# EAGLE schematic board (EAGLE 6.5.0)

## Sheet 1 of 4: Digital I/O
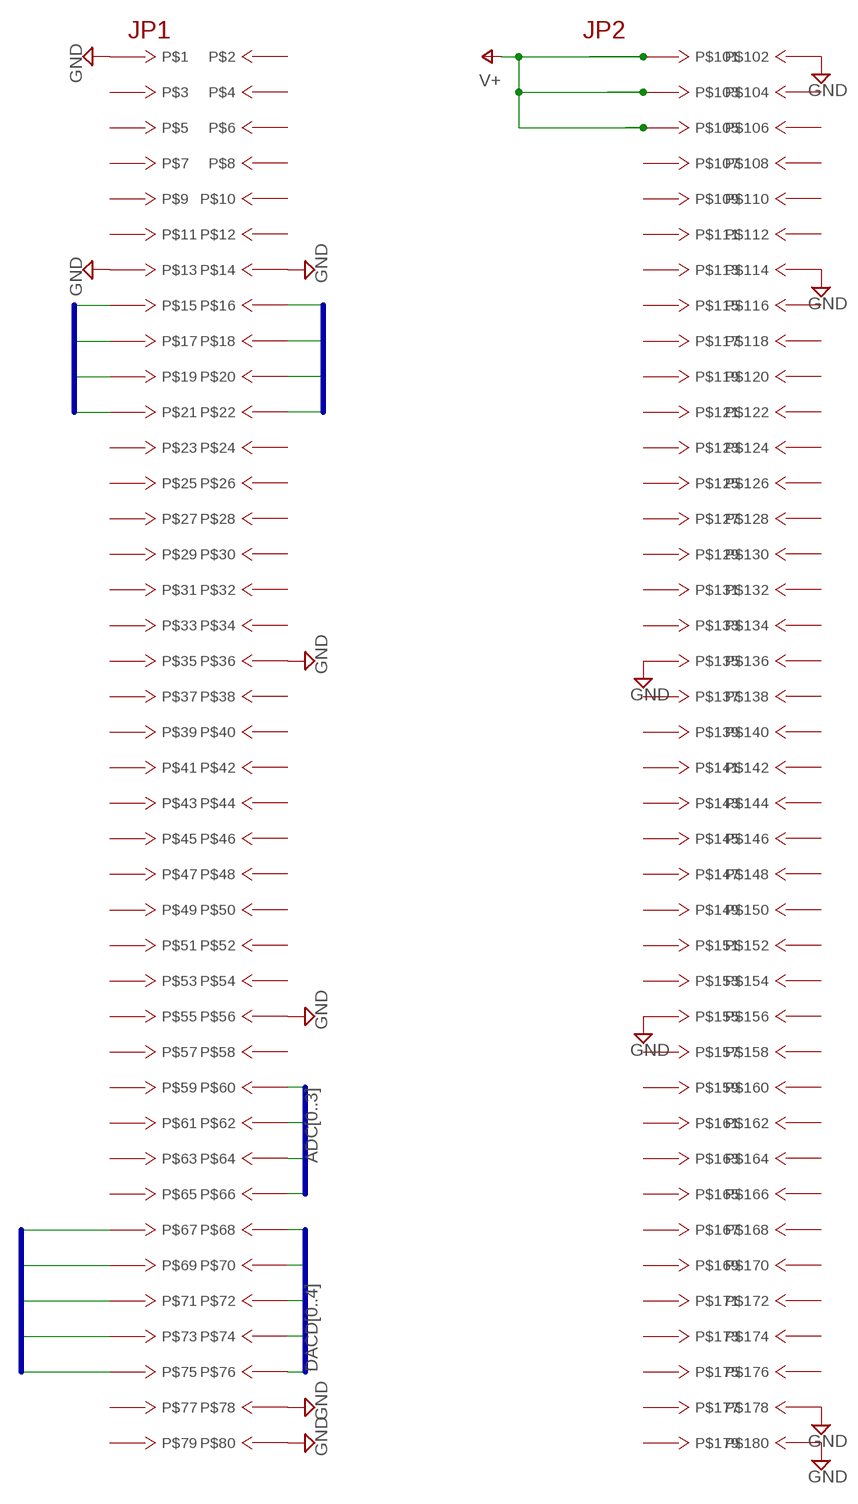
[diagram p0: schematic, sheet 1]

### Parts
J1  XEM6310  [XEM6310]

### Nets
ADC0: J1.266 ; also sheet 3
ADC1: J1.264 ; also sheet 3
ADC2: J1.262 ; also sheet 3
ADC3: J1.260 ; also sheet 3
ADC7: J1.222 ; also sheet 3
ADC8: J1.220 ; also sheet 3
ADC9: J1.218 ; also sheet 3
ADC10: J1.216 ; also sheet 3
ADC11: J1.221 ; also sheet 3
ADC12: J1.219 ; also sheet 3
ADC13: J1.217 ; also sheet 3
ADC14: J1.215 ; also sheet 3
DACD0: J1.268 ; also sheet 4
DACD1: J1.270 ; also sheet 4
DACD2: J1.272 ; also sheet 4
DACD3: J1.274 ; also sheet 4
DACD4: J1.276 ; also sheet 4
DACD5: J1.267 ; also sheet 4
DACD6: J1.269 ; also sheet 4
DACD7: J1.271 ; also sheet 4
DACD8: J1.273 ; also sheet 4
DACD9: J1.275 ; also sheet 4
GND: J1.102 J1.114 J1.135 J1.155 J1.178 J1.180 J1.201 J1.213 J1.214 J1.236 J1.256 J1.278 J1.280 ; also sheet 2,3,4
V+: J1.101 J1.103 J1.105 ; also sheet 2
Unconnected: J1.104 J1.106 J1.107 J1.108 J1.109 J1.110 J1.111 J1.112 J1.113 J1.115 J1.116 J1.117 J1.118 J1.119 J1.120 J1.121 J1.122 J1.123 J1.124 J1.125 J1.126 J1.127 J1.128 J1.129 J1.130 J1.131 J1.132 J1.133 J1.134 J1.136 J1.137 J1.138 J1.139 J1.140 J1.141 J1.142 J1.143 J1.144 J1.145 J1.146 J1.147 J1.148 J1.149 J1.150 J1.151 J1.152 J1.153 J1.154 J1.156 J1.157 J1.158 J1.159 J1.160 J1.161 J1.162 J1.163 J1.164 J1.165 J1.166 J1.167 J1.168 J1.169 J1.170 J1.171 J1.172 J1.173 J1.174 J1.175 J1.176 J1.177 J1.179 J1.202 J1.203 J1.204 J1.205 J1.206 J1.207 J1.208 J1.209 J1.210 J1.211 J1.212 J1.223 J1.224 J1.225 J1.226 J1.227 J1.228 J1.229 J1.230 J1.231 J1.232 J1.233 J1.234 J1.235 J1.237 J1.238 J1.239 J1.240 J1.241 J1.242 J1.243 J1.244 J1.245 J1.246 J1.247 J1.248 J1.249 J1.250 J1.251 J1.252 J1.253 J1.254 J1.255 J1.257 J1.258 J1.259 J1.261 J1.263 J1.265 J1.277 J1.279

### Buses
DACD[0..4]
ADC[0..3]
ADC[7..10]
ADC[11..14]
DACD[5..9]

## Sheet 2 of 4: Power
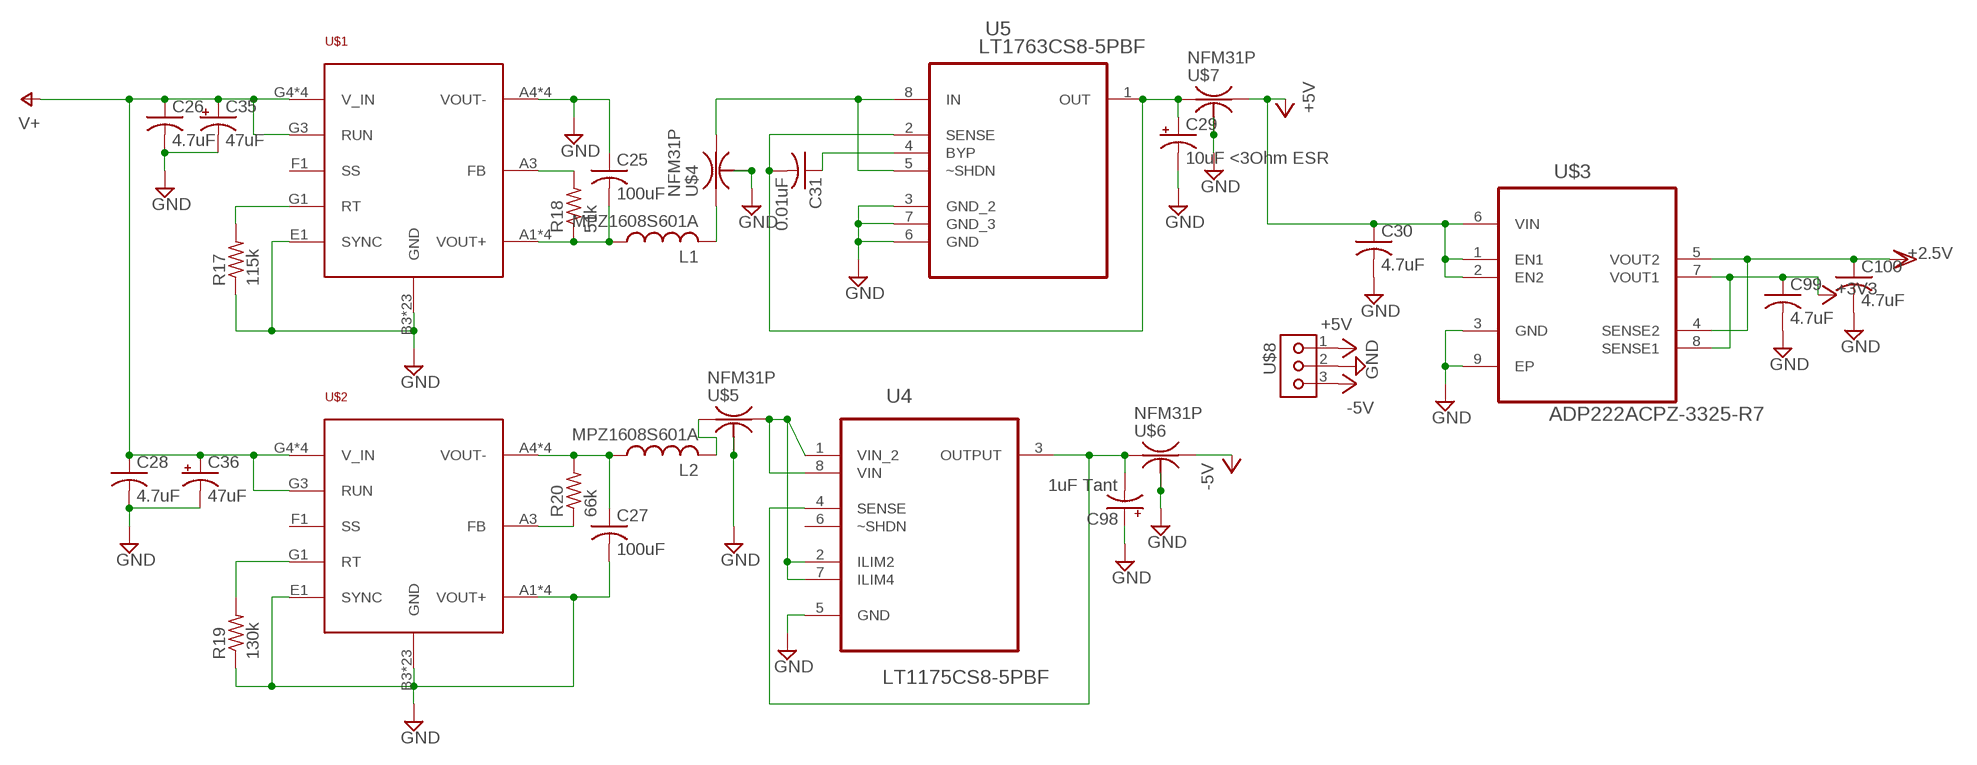
[diagram p1: schematic, sheet 2]

### Parts
C25  100uF  C-USC1210  [C1210]
C26  4.7uF  C-USC0603  [C0603]
C27  100uF  C-USC1210  [C1210]
C28  4.7uF  C-USC0603  [C0603]
C29  10uF <3Ohm ESR  CPOL-US  [C0603T]
C30  4.7uF  C-USC0603  [C0603]
C31  0.01uF  C-USC0603  [C0603]
C35  47uF  CPOL-USUD-4X5,8  [UD-4X5,8_NICHICON]
C36  47uF  CPOL-USUD-4X5,8  [UD-4X5,8_NICHICON]
C98  1uF Tant  CPOL-US  [C0603T]
C99  4.7uF  C-USC0603  [C0603]
C100  4.7uF  C-USC0603  [C0603]
L1  MPZ1608S601A  L-US  [C0603]
L2  MPZ1608S601A  L-US  [C0603]
R17  115k  R-US_R0603  [R0603]
R18  51k  R-US_R0603  [R0603]
R19  130k  R-US_R0603  [R0603]
R20  66k  R-US_R0603  [R0603]
U4  LT1175CS8-5PBF  [SOIC127P600X175-8N]
U5  LT1763CS8-5PBF  [SOIC127P600X175-8N]
U$1  LTM8045  [BGA-40]
U$2  LTM8045  [BGA-40]
U$3  ADP222ACPZ-3325-R7  [QFN50P200X200X60-9N]
U$4  NFM31P  [NFM31P]
U$5  NFM31P  [NFM31P]
U$6  NFM31P  [NFM31P]
U$7  NFM31P  [NFM31P]
U$8  KK3V  [KK-V-3]

### Nets
+3V3: C99.1 U$3.7(VOUT1) U$3.8(SENSE1) ; also sheet 3,4
+5V: C30.1 U$3.1(EN1) U$3.2(EN2) U$3.6(VIN) U$7.OUT U$8.1 ; also sheet 3,4
-5V: U$6.OUT U$8.3 ; also sheet 3,4
GND: C25.1 C26.2 C27.2 C28.2 C29.- C30.2 C35.- C36.- C98.+ C99.2 C100.2 R17.1 R19.1 U4.5(GND) U5.3(GND_2) U5.6(GND) U5.7(GND_3) U$1.A4(VOUT-) U$1.A5(VOUT-) U$1.B3(GND) U$1.B4(VOUT-) U$1.B5(VOUT-) U$1.C1(GND) U$1.C2(GND) U$1.C3(GND) U$1.C4(GND) U$1.C5(GND) U$1.D1(GND) U$1.D2(GND) U$1.D3(GND) U$1.D4(GND) U$1.D5(GND) U$1.E1(SYNC) U$1.E2(GND) U$1.E3(GND) U$1.E4(GND) U$1.E5(GND) U$1.F2(GND) U$1.F3(GND) U$1.F4(GND) U$1.F5(GND) U$1.G2(GND) U$1.H1(GND) U$1.H2(GND) U$1.H3(GND) U$2.A1(VOUT+) U$2.A2(VOUT+) U$2.B1(VOUT+) U$2.B2(VOUT+) U$2.B3(GND) U$2.C1(GND) U$2.C2(GND) U$2.C3(GND) U$2.C4(GND) U$2.C5(GND) U$2.D1(GND) U$2.D2(GND) U$2.D3(GND) U$2.D4(GND) U$2.D5(GND) U$2.E1(SYNC) U$2.E2(GND) U$2.E3(GND) U$2.E4(GND) U$2.E5(GND) U$2.F2(GND) U$2.F3(GND) U$2.F4(GND) U$2.F5(GND) U$2.G2(GND) U$2.H1(GND) U$2.H2(GND) U$2.H3(GND) U$3.3(GND) U$3.9(EP) U$4.GND U$4.GND2 U$5.GND U$5.GND2 U$6.GND U$6.GND2 U$7.GND U$7.GND2 U$8.2 ; also sheet 1,3,4
N$27: L1.2 U$4.IN
N$30: R19.2 U$2.G1(RT)
N$32: R17.2 U$1.G1(RT)
N$34: R18.2 U$1.A3(FB)
N$35: C25.2 L1.1 R18.1 U$1.A1(VOUT+) U$1.A2(VOUT+) U$1.B1(VOUT+) U$1.B2(VOUT+)
N$37: C27.1 L2.1 R20.2 U$2.A4(VOUT-) U$2.A5(VOUT-) U$2.B4(VOUT-) U$2.B5(VOUT-)
N$38: R20.1 U$2.A3(FB)
N$41: L2.2 U$5.IN
N$48: U4.1(VIN_2) U4.2(ILIM2) U4.7(ILIM4) U4.8(VIN) U$5.OUT
N$49: C31.1 U5.4(BYP)
N$65: U5.5(~SHDN) U5.8(IN) U$4.OUT
N$66: C98.- U4.3(OUTPUT) U4.4(SENSE) U$6.IN
N$67: C29.+ C31.2 U5.1(OUT) U5.2(SENSE) U$7.IN
V+: C26.1 C28.1 C35.+ C36.+ U$1.G3(RUN) U$1.G4(V_IN) U$1.G5(V_IN) U$1.H4(V_IN) U$1.H5(V_IN) U$2.G3(RUN) U$2.G4(V_IN) U$2.G5(V_IN) U$2.H4(V_IN) U$2.H5(V_IN) ; also sheet 1
VDD: C100.1 U$3.4(SENSE2) U$3.5(VOUT2) ; supply symbol labelled +2.5V ; also sheet 3
Unconnected: U4.6(~SHDN) U$1.F1(SS) U$2.F1(SS)

## Sheet 3 of 4: ADCs
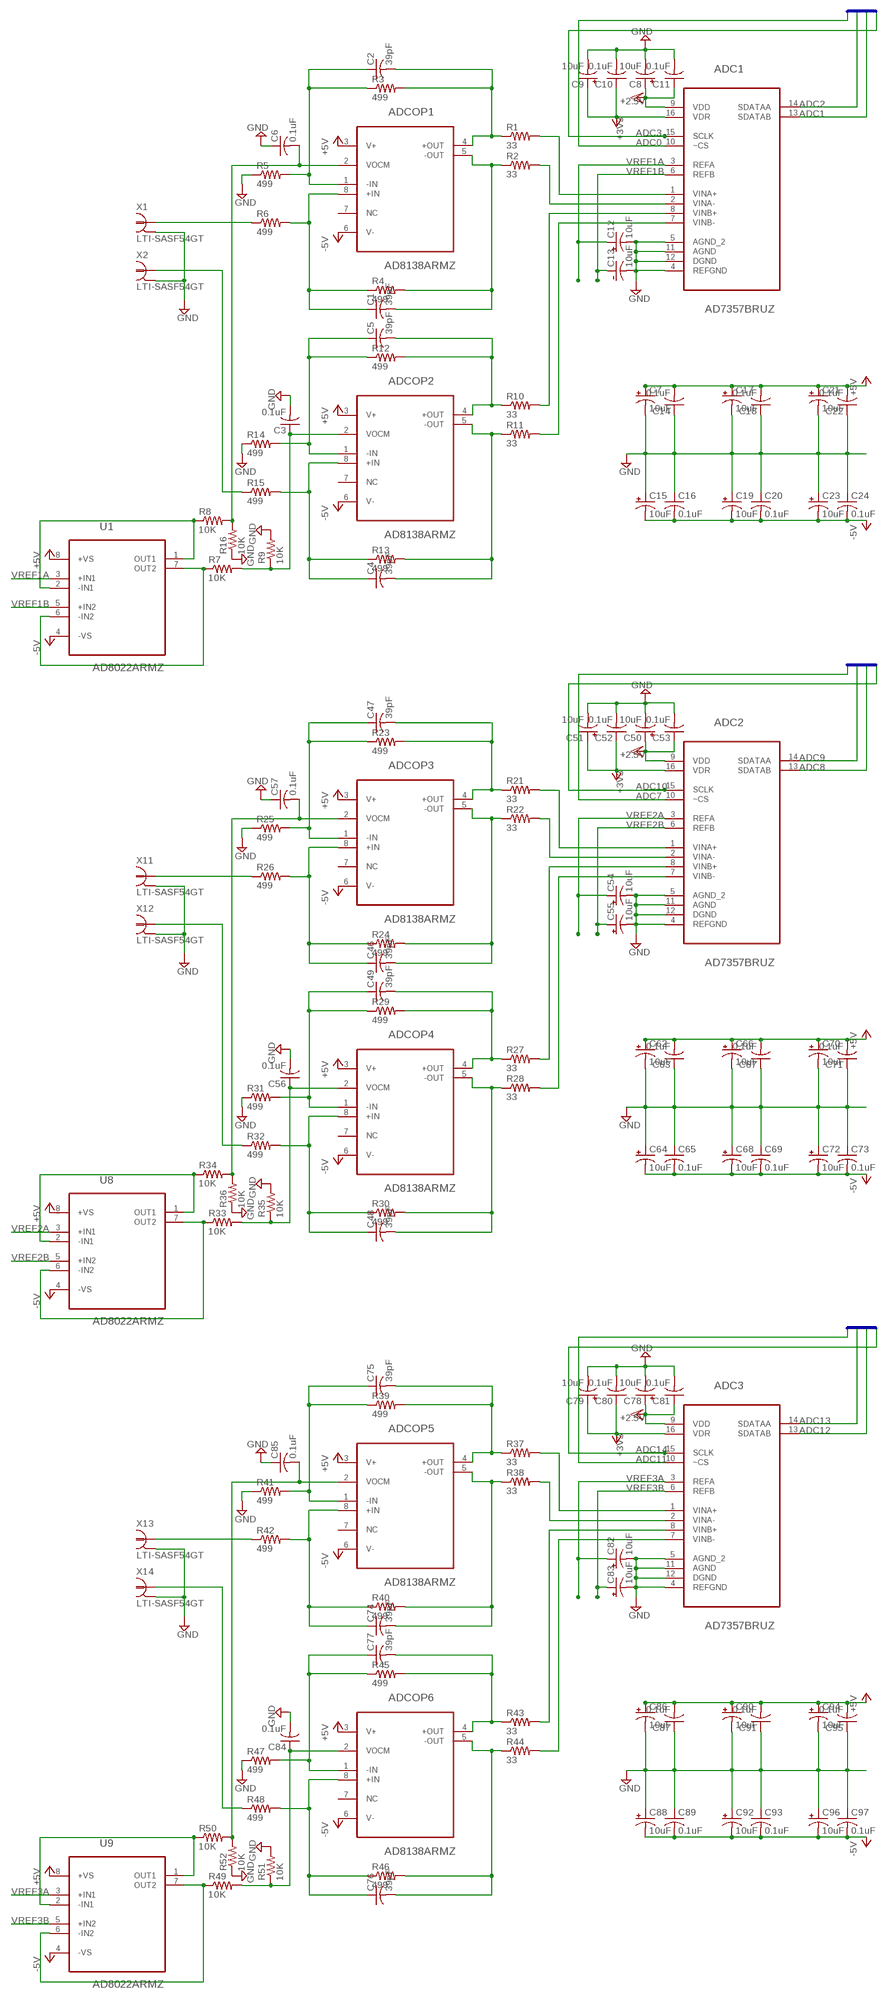
[diagram p2: schematic, sheet 3]

### Parts
ADC1  AD7357BRUZ  [SOP65P640X120-16N]
ADC2  AD7357BRUZ  [SOP65P640X120-16N]
ADC3  AD7357BRUZ  [SOP65P640X120-16N]
ADCOP1  AD8138ARMZ  [SOP65P490X110-8N]
ADCOP2  AD8138ARMZ  [SOP65P490X110-8N]
ADCOP3  AD8138ARMZ  [SOP65P490X110-8N]
ADCOP4  AD8138ARMZ  [SOP65P490X110-8N]
ADCOP5  AD8138ARMZ  [SOP65P490X110-8N]
ADCOP6  AD8138ARMZ  [SOP65P490X110-8N]
C1  39pF  C-USC0603  [C0603]
C2  39pF  C-USC0603  [C0603]
C3  0.1uF  C-USC0603  [C0603]
C4  39pF  C-USC0603  [C0603]
C5  39pF  C-USC0603  [C0603]
C6  0.1uF  C-USC0603  [C0603]
C7  10uF  CPOL-US  [C0603T]
C8  10uF  CPOL-US  [C0603T]
C9  10uF  CPOL-US  [C0603T]
C10  0.1uF  C-USC0603  [C0603]
C11  0.1uF  C-USC0603  [C0603]
C12  10uF  CPOL-US  [C0603T]
C13  10uF  CPOL-US  [C0603T]
C14  0.1uF  C-USC0603  [C0603]
C15  10uF  CPOL-US  [C0603T]
C16  0.1uF  C-USC0603  [C0603]
C17  10uF  CPOL-US  [C0603T]
C18  0.1uF  C-USC0603  [C0603]
C19  10uF  CPOL-US  [C0603T]
C20  0.1uF  C-USC0603  [C0603]
C21  10uF  CPOL-US  [C0603T]
C22  0.1uF  C-USC0603  [C0603]
C23  10uF  CPOL-US  [C0603T]
C24  0.1uF  C-USC0603  [C0603]
C46  39pF  C-USC0603  [C0603]
C47  39pF  C-USC0603  [C0603]
C48  39pF  C-USC0603  [C0603]
C49  39pF  C-USC0603  [C0603]
C50  10uF  CPOL-US  [C0603T]
C51  10uF  CPOL-US  [C0603T]
C52  0.1uF  C-USC0603  [C0603]
C53  0.1uF  C-USC0603  [C0603]
C54  10uF  CPOL-US  [C0603T]
C55  10uF  CPOL-US  [C0603T]
C56  0.1uF  C-USC0603  [C0603]
C57  0.1uF  C-USC0603  [C0603]
C62  10uF  CPOL-US  [C0603T]
C63  0.1uF  C-USC0603  [C0603]
C64  10uF  CPOL-US  [C0603T]
C65  0.1uF  C-USC0603  [C0603]
C66  10uF  CPOL-US  [C0603T]
C67  0.1uF  C-USC0603  [C0603]
C68  10uF  CPOL-US  [C0603T]
C69  0.1uF  C-USC0603  [C0603]
C70  10uF  CPOL-US  [C0603T]
C71  0.1uF  C-USC0603  [C0603]
C72  10uF  CPOL-US  [C0603T]
C73  0.1uF  C-USC0603  [C0603]
C74  39pF  C-USC0603  [C0603]
C75  39pF  C-USC0603  [C0603]
C76  39pF  C-USC0603  [C0603]
C77  39pF  C-USC0603  [C0603]
C78  10uF  CPOL-US  [C0603T]
C79  10uF  CPOL-US  [C0603T]
C80  0.1uF  C-USC0603  [C0603]
C81  0.1uF  C-USC0603  [C0603]
C82  10uF  CPOL-US  [C0603T]
C83  10uF  CPOL-US  [C0603T]
C84  0.1uF  C-USC0603  [C0603]
C85  0.1uF  C-USC0603  [C0603]
C86  10uF  CPOL-US  [C0603T]
C87  0.1uF  C-USC0603  [C0603]
C88  10uF  CPOL-US  [C0603T]
C89  0.1uF  C-USC0603  [C0603]
C90  10uF  CPOL-US  [C0603T]
C91  0.1uF  C-USC0603  [C0603]
C92  10uF  CPOL-US  [C0603T]
C93  0.1uF  C-USC0603  [C0603]
C94  10uF  CPOL-US  [C0603T]
C95  0.1uF  C-USC0603  [C0603]
C96  10uF  CPOL-US  [C0603T]
C97  0.1uF  C-USC0603  [C0603]
R1  33  R-US_R0603  [R0603]
R2  33  R-US_R0603  [R0603]
R3  499  R-US_R0603  [R0603]
R4  499  R-US_R0603  [R0603]
R5  499  R-US_R0603  [R0603]
R6  499  R-US_R0603  [R0603]
R7  10K  R-US_R0603  [R0603]
R8  10K  R-US_R0603  [R0603]
R9  10K  R-US_R0603  [R0603]
R10  33  R-US_R0603  [R0603]
R11  33  R-US_R0603  [R0603]
R12  499  R-US_R0603  [R0603]
R13  499  R-US_R0603  [R0603]
R14  499  R-US_R0603  [R0603]
R15  499  R-US_R0603  [R0603]
R16  10K  R-US_R0603  [R0603]
R21  33  R-US_R0603  [R0603]
R22  33  R-US_R0603  [R0603]
R23  499  R-US_R0603  [R0603]
R24  499  R-US_R0603  [R0603]
R25  499  R-US_R0603  [R0603]
R26  499  R-US_R0603  [R0603]
R27  33  R-US_R0603  [R0603]
R28  33  R-US_R0603  [R0603]
R29  499  R-US_R0603  [R0603]
R30  499  R-US_R0603  [R0603]
R31  499  R-US_R0603  [R0603]
R32  499  R-US_R0603  [R0603]
R33  10K  R-US_R0603  [R0603]
R34  10K  R-US_R0603  [R0603]
R35  10K  R-US_R0603  [R0603]
R36  10K  R-US_R0603  [R0603]
R37  33  R-US_R0603  [R0603]
R38  33  R-US_R0603  [R0603]
R39  499  R-US_R0603  [R0603]
R40  499  R-US_R0603  [R0603]
R41  499  R-US_R0603  [R0603]
R42  499  R-US_R0603  [R0603]
R43  33  R-US_R0603  [R0603]
R44  33  R-US_R0603  [R0603]
R45  499  R-US_R0603  [R0603]
R46  499  R-US_R0603  [R0603]
R47  499  R-US_R0603  [R0603]
R48  499  R-US_R0603  [R0603]
R49  10K  R-US_R0603  [R0603]
R50  10K  R-US_R0603  [R0603]
R51  10K  R-US_R0603  [R0603]
R52  10K  R-US_R0603  [R0603]
U1  AD8022ARMZ  [SOP65P490X110-8N]
U8  AD8022ARMZ  [SOP65P490X110-8N]
U9  AD8022ARMZ  [SOP65P490X110-8N]
X1  LTI-SASF54GT  [LTI-SASF54GT]
X2  LTI-SASF54GT  [LTI-SASF54GT]
X11  LTI-SASF54GT  [LTI-SASF54GT]
X12  LTI-SASF54GT  [LTI-SASF54GT]
X13  LTI-SASF54GT  [LTI-SASF54GT]
X14  LTI-SASF54GT  [LTI-SASF54GT]

### Nets
+3V3: ADC1.16(VDR) ADC2.16(VDR) ADC3.16(VDR) C9.+ C10.1 C51.+ C52.1 C79.+ C80.1 ; also sheet 2,4
+5V: ADCOP1.3(V+) ADCOP2.3(V+) ADCOP3.3(V+) ADCOP4.3(V+) ADCOP5.3(V+) ADCOP6.3(V+) C7.+ C14.2 C17.+ C18.2 C21.+ C22.2 C62.+ C63.2 C66.+ C67.2 C70.+ C71.2 C86.+ C87.2 C90.+ C91.2 C94.+ C95.2 U1.8(+VS) U8.8(+VS) U9.8(+VS) ; also sheet 2,4
-5V: ADCOP1.6(V-) ADCOP2.6(V-) ADCOP3.6(V-) ADCOP4.6(V-) ADCOP5.6(V-) ADCOP6.6(V-) C15.- C16.2 C19.- C20.2 C23.- C24.2 C64.- C65.2 C68.- C69.2 C72.- C73.2 C88.- C89.2 C92.- C93.2 C96.- C97.2 U1.4(-VS) U8.4(-VS) U9.4(-VS) ; also sheet 2,4
ADC0: ADC1.10(~CS) ; also sheet 1
ADC1: ADC1.13(SDATAB) ; also sheet 1
ADC2: ADC1.14(SDATAA) ; also sheet 1
ADC3: ADC1.15(SCLK) ; also sheet 1
ADC7: ADC2.10(~CS) ; also sheet 1
ADC8: ADC2.13(SDATAB) ; also sheet 1
ADC9: ADC2.14(SDATAA) ; also sheet 1
ADC10: ADC2.15(SCLK) ; also sheet 1
ADC11: ADC3.10(~CS) ; also sheet 1
ADC12: ADC3.13(SDATAB) ; also sheet 1
ADC13: ADC3.14(SDATAA) ; also sheet 1
ADC14: ADC3.15(SCLK) ; also sheet 1
GND: ADC1.4(REFGND) ADC1.5(AGND_2) ADC1.11(AGND) ADC1.12(DGND) ADC2.4(REFGND) ADC2.5(AGND_2) ADC2.11(AGND) ADC2.12(DGND) ADC3.4(REFGND) ADC3.5(AGND_2) ADC3.11(AGND) ADC3.12(DGND) C3.2 C6.1 C7.- C8.- C9.- C10.2 C11.2 C12.- C13.- C14.1 C15.+ C16.1 C17.- C18.1 C19.+ C20.1 C21.- C22.1 C23.+ C24.1 C50.- C51.- C52.2 C53.2 C54.- C55.- C56.2 C57.1 C62.- C63.1 C64.+ C65.1 C66.- C67.1 C68.+ C69.1 C70.- C71.1 C72.+ C73.1 C78.- C79.- C80.2 C81.2 C82.- C83.- C84.2 C85.1 C86.- C87.1 C88.+ C89.1 C90.- C91.1 C92.+ C93.1 C94.- C95.1 C96.+ C97.1 R5.1 R9.2 R14.1 R16.1 R25.1 R31.1 R35.2 R36.1 R41.1 R47.1 R51.2 R52.1 X1.2 X1.3 X1.4 X1.5 X2.2 X2.3 X2.4 X2.5 X11.2 X11.3 X11.4 X11.5 X12.2 X12.3 X12.4 X12.5 X13.2 X13.3 X13.4 X13.5 X14.2 X14.3 X14.4 X14.5 ; also sheet 1,2,4
N$1: ADC1.8(VINB+) R10.2
N$2: ADCOP1.5(-OUT) C1.2 R2.1 R4.2
N$3: ADCOP1.1(-IN) C2.1 R3.1 R5.2
N$4: ADCOP1.8(+IN) C1.1 R4.1 R6.2
N$7: R7.1 U1.6(-IN2) U1.7(OUT2)
N$8: R8.1 U1.1(OUT1) U1.2(-IN1)
N$9: ADCOP1.2(VOCM) C6.2 R8.2 R16.2
N$10: ADC1.1(VINA+) R1.2
N$11: ADC1.2(VINA-) R2.2
N$12: ADCOP1.4(+OUT) C2.2 R1.1 R3.2
N$13: ADC1.7(VINB-) R11.2
N$14: ADCOP2.5(-OUT) C4.2 R11.1 R13.2
N$15: ADCOP2.1(-IN) C5.1 R12.1 R14.2
N$16: ADCOP2.8(+IN) C4.1 R13.1 R15.2
N$17: ADCOP2.2(VOCM) C3.1 R7.2 R9.1
N$20: ADCOP2.4(+OUT) C5.2 R10.1 R12.2
N$24: R15.1 X2.1
N$25: R6.1 X1.1
N$47: ADCOP3.5(-OUT) C46.2 R22.1 R24.2
N$51: ADCOP3.1(-IN) C47.1 R23.1 R25.2
N$52: ADCOP3.8(+IN) C46.1 R24.1 R26.2
N$54: ADC2.1(VINA+) R21.2
N$57: ADC2.2(VINA-) R22.2
N$59: ADCOP3.4(+OUT) C47.2 R21.1 R23.2
N$60: ADCOP4.5(-OUT) C48.2 R28.1 R30.2
N$62: ADCOP4.1(-IN) C49.1 R29.1 R31.2
N$63: ADCOP4.8(+IN) C48.1 R30.1 R32.2
N$64: ADCOP4.4(+OUT) C49.2 R27.1 R29.2
N$68: ADC2.8(VINB+) R27.2
N$69: ADC2.7(VINB-) R28.2
N$70: R32.1 X12.1
N$71: R26.1 X11.1
N$72: R33.1 U8.6(-IN2) U8.7(OUT2)
N$73: R34.1 U8.1(OUT1) U8.2(-IN1)
N$74: ADCOP3.2(VOCM) C57.2 R34.2 R36.2
N$75: ADCOP4.2(VOCM) C56.1 R33.2 R35.1
N$76: ADCOP5.5(-OUT) C74.2 R38.1 R40.2
N$77: ADCOP5.1(-IN) C75.1 R39.1 R41.2
N$78: ADCOP5.8(+IN) C74.1 R40.1 R42.2
N$79: ADC3.1(VINA+) R37.2
N$80: ADC3.2(VINA-) R38.2
N$81: ADCOP5.4(+OUT) C75.2 R37.1 R39.2
N$82: ADCOP6.5(-OUT) C76.2 R44.1 R46.2
N$83: ADCOP6.1(-IN) C77.1 R45.1 R47.2
N$84: ADCOP6.8(+IN) C76.1 R46.1 R48.2
N$85: ADCOP6.4(+OUT) C77.2 R43.1 R45.2
N$86: ADC3.8(VINB+) R43.2
N$87: ADC3.7(VINB-) R44.2
N$88: R48.1 X14.1
N$89: R42.1 X13.1
N$90: R49.1 U9.6(-IN2) U9.7(OUT2)
N$91: R50.1 U9.1(OUT1) U9.2(-IN1)
N$92: ADCOP5.2(VOCM) C85.2 R50.2 R52.2
N$93: ADCOP6.2(VOCM) C84.1 R49.2 R51.1
VDD: ADC1.9(VDD) ADC2.9(VDD) ADC3.9(VDD) C8.+ C11.1 C50.+ C53.1 C78.+ C81.1 ; supply symbol labelled +2.5V ; also sheet 2
VREF1A: ADC1.3(REFA) C12.+ U1.3(+IN1)
VREF1B: ADC1.6(REFB) C13.+ U1.5(+IN2)
VREF2A: ADC2.3(REFA) C54.+ U8.3(+IN1)
VREF2B: ADC2.6(REFB) C55.+ U8.5(+IN2)
VREF3A: ADC3.3(REFA) C82.+ U9.3(+IN1)
VREF3B: ADC3.6(REFB) C83.+ U9.5(+IN2)
Unconnected: ADCOP1.7(NC) ADCOP2.7(NC) ADCOP3.7(NC) ADCOP4.7(NC) ADCOP5.7(NC) ADCOP6.7(NC)

### Buses
ADC[11..14]
ADC[0..3]
ADC[7..10]

## Sheet 4 of 4: DAC 1
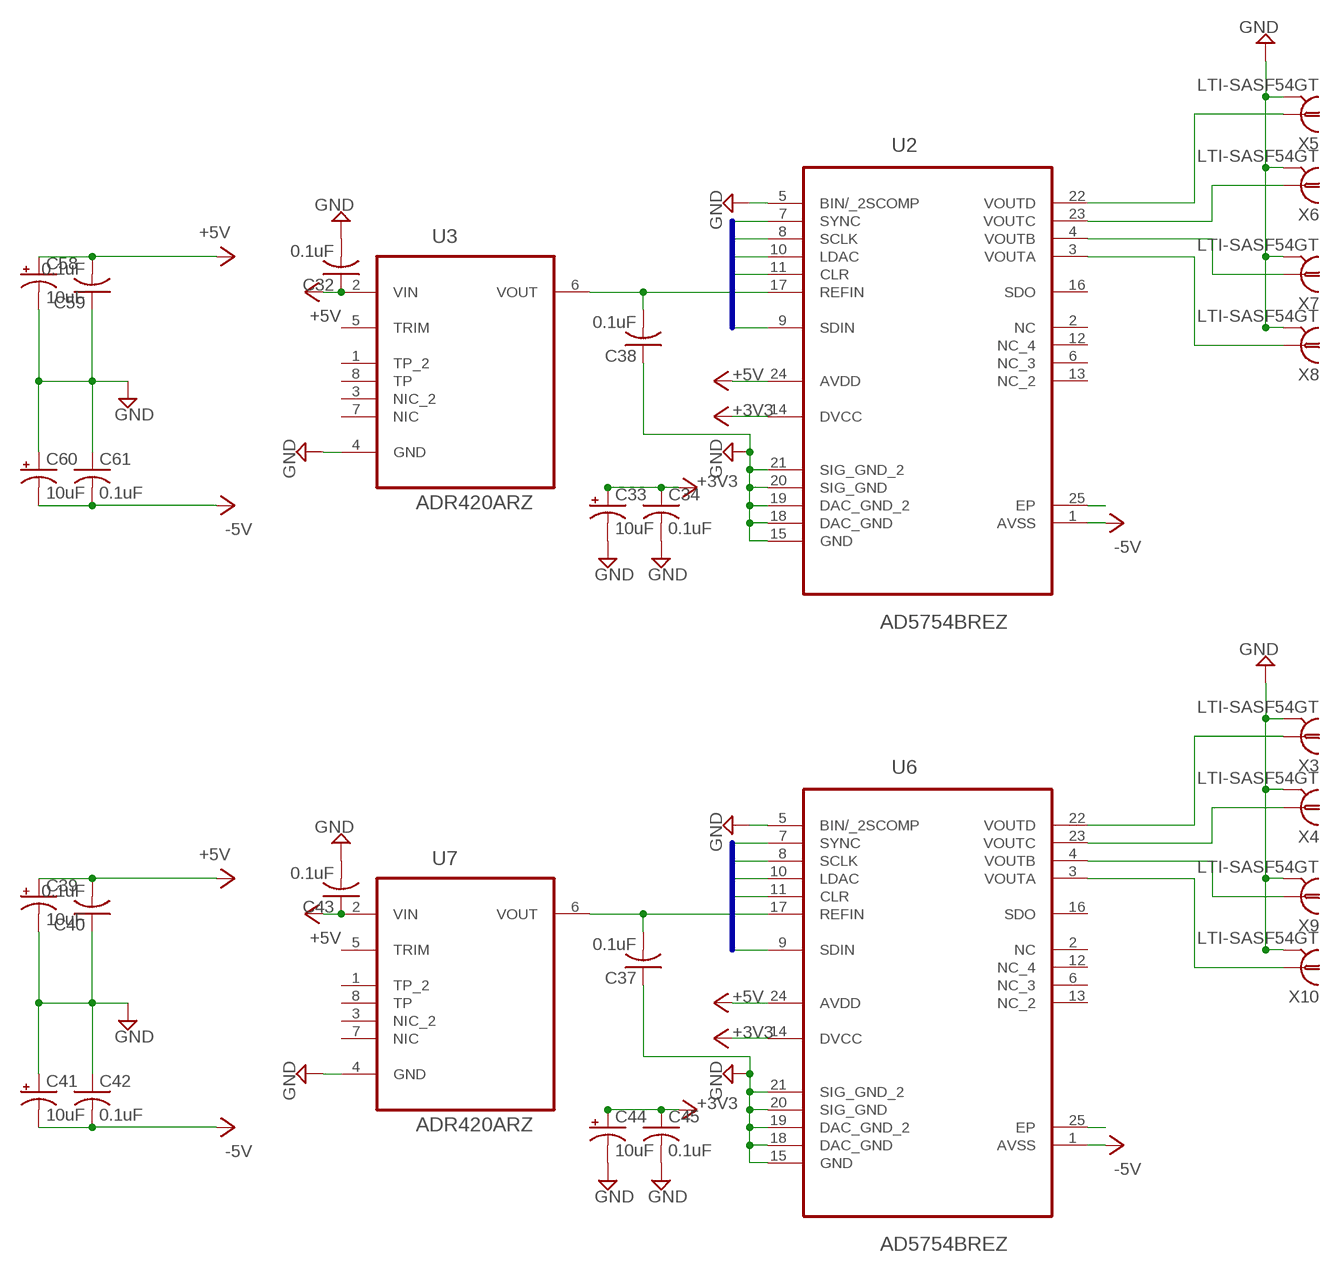
[diagram p3: schematic, sheet 4]

### Parts
C32  0.1uF  C-USC0603  [C0603]
C33  10uF  CPOL-US  [C0603T]
C34  0.1uF  C-USC0603  [C0603]
C37  0.1uF  C-USC0603  [C0603]
C38  0.1uF  C-USC0603  [C0603]
C39  10uF  CPOL-US  [C0603T]
C40  0.1uF  C-USC0603  [C0603]
C41  10uF  CPOL-US  [C0603T]
C42  0.1uF  C-USC0603  [C0603]
C43  0.1uF  C-USC0603  [C0603]
C44  10uF  CPOL-US  [C0603T]
C45  0.1uF  C-USC0603  [C0603]
C58  10uF  CPOL-US  [C0603T]
C59  0.1uF  C-USC0603  [C0603]
C60  10uF  CPOL-US  [C0603T]
C61  0.1uF  C-USC0603  [C0603]
U2  AD5754BREZ  [SOP65P640X120-25N]
U3  ADR420ARZ  [SOIC127P600X175-8N]
U6  AD5754BREZ  [SOP65P640X120-25N]
U7  ADR420ARZ  [SOIC127P600X175-8N]
X3  LTI-SASF54GT  [LTI-SASF54GT]
X4  LTI-SASF54GT  [LTI-SASF54GT]
X5  LTI-SASF54GT  [LTI-SASF54GT]
X6  LTI-SASF54GT  [LTI-SASF54GT]
X7  LTI-SASF54GT  [LTI-SASF54GT]
X8  LTI-SASF54GT  [LTI-SASF54GT]
X9  LTI-SASF54GT  [LTI-SASF54GT]
X10  LTI-SASF54GT  [LTI-SASF54GT]

### Nets
+3V3: C33.+ C34.1 C44.+ C45.1 U2.14(DVCC) U6.14(DVCC) ; also sheet 2,3
+5V: C32.1 C39.+ C40.2 C43.1 C58.+ C59.2 U2.24(AVDD) U3.2(VIN) U6.24(AVDD) U7.2(VIN) ; also sheet 2,3
-5V: C41.- C42.2 C60.- C61.2 U2.1(AVSS) U6.1(AVSS) ; also sheet 2,3
DACD0: U2.7(SYNC) ; also sheet 1
DACD1: U2.8(SCLK) ; also sheet 1
DACD2: U2.9(SDIN) ; also sheet 1
DACD3: U2.10(LDAC) ; also sheet 1
DACD4: U2.11(CLR) ; also sheet 1
DACD5: U6.7(SYNC) ; also sheet 1
DACD6: U6.8(SCLK) ; also sheet 1
DACD7: U6.9(SDIN) ; also sheet 1
DACD8: U6.10(LDAC) ; also sheet 1
DACD9: U6.11(CLR) ; also sheet 1
GND: C32.2 C33.- C34.2 C37.1 C38.1 C39.- C40.1 C41.+ C42.1 C43.2 C44.- C45.2 C58.- C59.1 C60.+ C61.1 U2.5(BIN/_2SCOMP) U2.15(GND) U2.18(DAC_GND) U2.19(DAC_GND_2) U2.20(SIG_GND) U2.21(SIG_GND_2) U3.4(GND) U6.5(BIN/_2SCOMP) U6.15(GND) U6.18(DAC_GND) U6.19(DAC_GND_2) U6.20(SIG_GND) U6.21(SIG_GND_2) U7.4(GND) X3.2 X3.3 X3.4 X3.5 X4.2 X4.3 X4.4 X4.5 X5.2 X5.3 X5.4 X5.5 X6.2 X6.3 X6.4 X6.5 X7.2 X7.3 X7.4 X7.5 X8.2 X8.3 X8.4 X8.5 X9.2 X9.3 X9.4 X9.5 X10.2 X10.3 X10.4 X10.5 ; also sheet 1,2,3
N$5: U2.22(VOUTD) X5.1
N$18: U2.4(VOUTB) X7.1
N$19: U2.23(VOUTC) X6.1
N$21: U2.3(VOUTA) X8.1
N$22: C38.2 U2.17(REFIN) U3.6(VOUT)
N$36: U6.22(VOUTD) X3.1
N$42: U6.4(VOUTB) X9.1
N$43: U6.23(VOUTC) X4.1
N$45: U6.3(VOUTA) X10.1
N$46: C37.2 U6.17(REFIN) U7.6(VOUT)
N$94: U6.25(EP)
N$95: U2.25(EP)
Unconnected: U2.2(NC) U2.6(NC_3) U2.12(NC_4) U2.13(NC_2) U2.16(SDO) U3.1(TP_2) U3.3(NIC_2) U3.5(TRIM) U3.7(NIC) U3.8(TP) U6.2(NC) U6.6(NC_3) U6.12(NC_4) U6.13(NC_2) U6.16(SDO) U7.1(TP_2) U7.3(NIC_2) U7.5(TRIM) U7.7(NIC) U7.8(TP)

### Buses
DACD[0..4]
DACD[5..9]

## Library data of the parts
ADC1-ADC3 = Analog Devices_By_element14_Batch_1:AD7357BRUZ: Differential Input, Dual, Simultaneous Sampling, 4.2 MSPS, 14-Bit, SAR ADC; MPN: AD7357BRUZ; OC_FARNELL: 1827289; OC_NEWARK: 11R1008; PACKAGE: TSSOP-16; SUPPLIER: Analog Devices
ADCOP1-ADCOP6 = Analog Devices_By_element14_Batch_1:AD8138ARMZ: Low Distortion Differential ADC Driver; MPN: AD8138ARMZ; OC_FARNELL: 1660991; OC_NEWARK: 19M8886; PACKAGE: MSOP-8; SUPPLIER: Analog Devices
C1-C6 C10 C11 C14 C16 C18 C20 C22 C24-C28 C30-C32 C34 C37 C38 C40 C42 C43 C45-C49 C52 C53 C56 C57 C59 C61 C63 C65 C67 C69 C71 C73-C77 C80 C81 C84 C85 C87 C89 C91 C93 C95 C97 C99 C100 = rcl:C-US: CAPACITOR, American symbol
C7-C9 C12 C13 C15 C17 C19 C21 C23 C29 C33 C35 C36 C39 C41 C44 C50 C51 C54 C55 C58 C60 C62 C64 C66 C68 C70 C72 C78 C79 C82 C83 C86 C88 C90 C92 C94 C96 C98 = rcl:CPOL-US: POLARIZED CAPACITOR, American symbol
J1 = adc:XEM6310
L1 L2 = rcl:L-US: INDUCTOR, American symbol
R1-R52 = resistor:R-US_: RESISTOR, American symbol
U1 U8 U9 = Analog Devices_By_element14_Batch_1:AD8022ARMZ: Dual High Speed,Low Noise Op Amp; MPN: AD8022ARMZ; OC_FARNELL: 1699612; OC_NEWARK: 59K6199; PACKAGE: MSOP-8; SUPPLIER: Analog Devices
U2 U6 = ADI-Phase-2:AD5754BREZ: IC, DAC, 16BIT, 100KSPS; MPN: AD5754BREZ; OC_FARNELL: 1776675; OC_NEWARK: 07P8940; PACKAGE: 24-Lead TSSOP_EP; SUPPLIER: Analog Devices
U3 U7 = Analog Devices_By_element14_Batch_1:ADR420ARZ: Ultraprecision, Low Noise, 2.048 V/2.500 V/ 3.00 V/5.00 V XFET® Voltage References; MPN: ADR420ARZ; OC_FARNELL: 9426086; OC_NEWARK: 19M0710; PACKAGE: SOIC-8; SUPPLIER: Analog Devices
U4 = LTC_By_element14_Batch_1:LT1175CS8-5PBF: 500mA Negative Low Dropout Micropower Regulator; MPN: LT1175CS8-5#PBF; OC_FARNELL: 1273580; OC_NEWARK: 57M2457; PACKAGE: SOIC-8; SUPPLIER: Linear Technologies
U5 = LTC_By_element14_Batch_1:LT1763CS8-5PBF: 500mA, Low Noise, LDO Micropower Regulators; MPN: LT1763CS8-5#PBF; OC_FARNELL: 1273618; OC_NEWARK: 57M6063; PACKAGE: SOIC-8; SUPPLIER: Linear Technologies
U$1 U$2 = adc:LTM8045
U$3 = ADI-Phase-2:ADP222ACPZ-3325-R7
U$4-U$7 = adc:NFM31P
U$8 = molex-kk:KK3*: Molex KK 3-pin connector, 100 mil pin spacing
X1-X14 = con-coax:LTI-SASF54GT: SMA vertical PCB thrue hole jack Source: Lighthorse Technologies, inc. SASF54GT.pdf; OC_FARNELL: unknown; OC_NEWARK: unknown